# EAGLE design Enclosure 100x68 BCS-A4a (EAGLE 9.6.2)
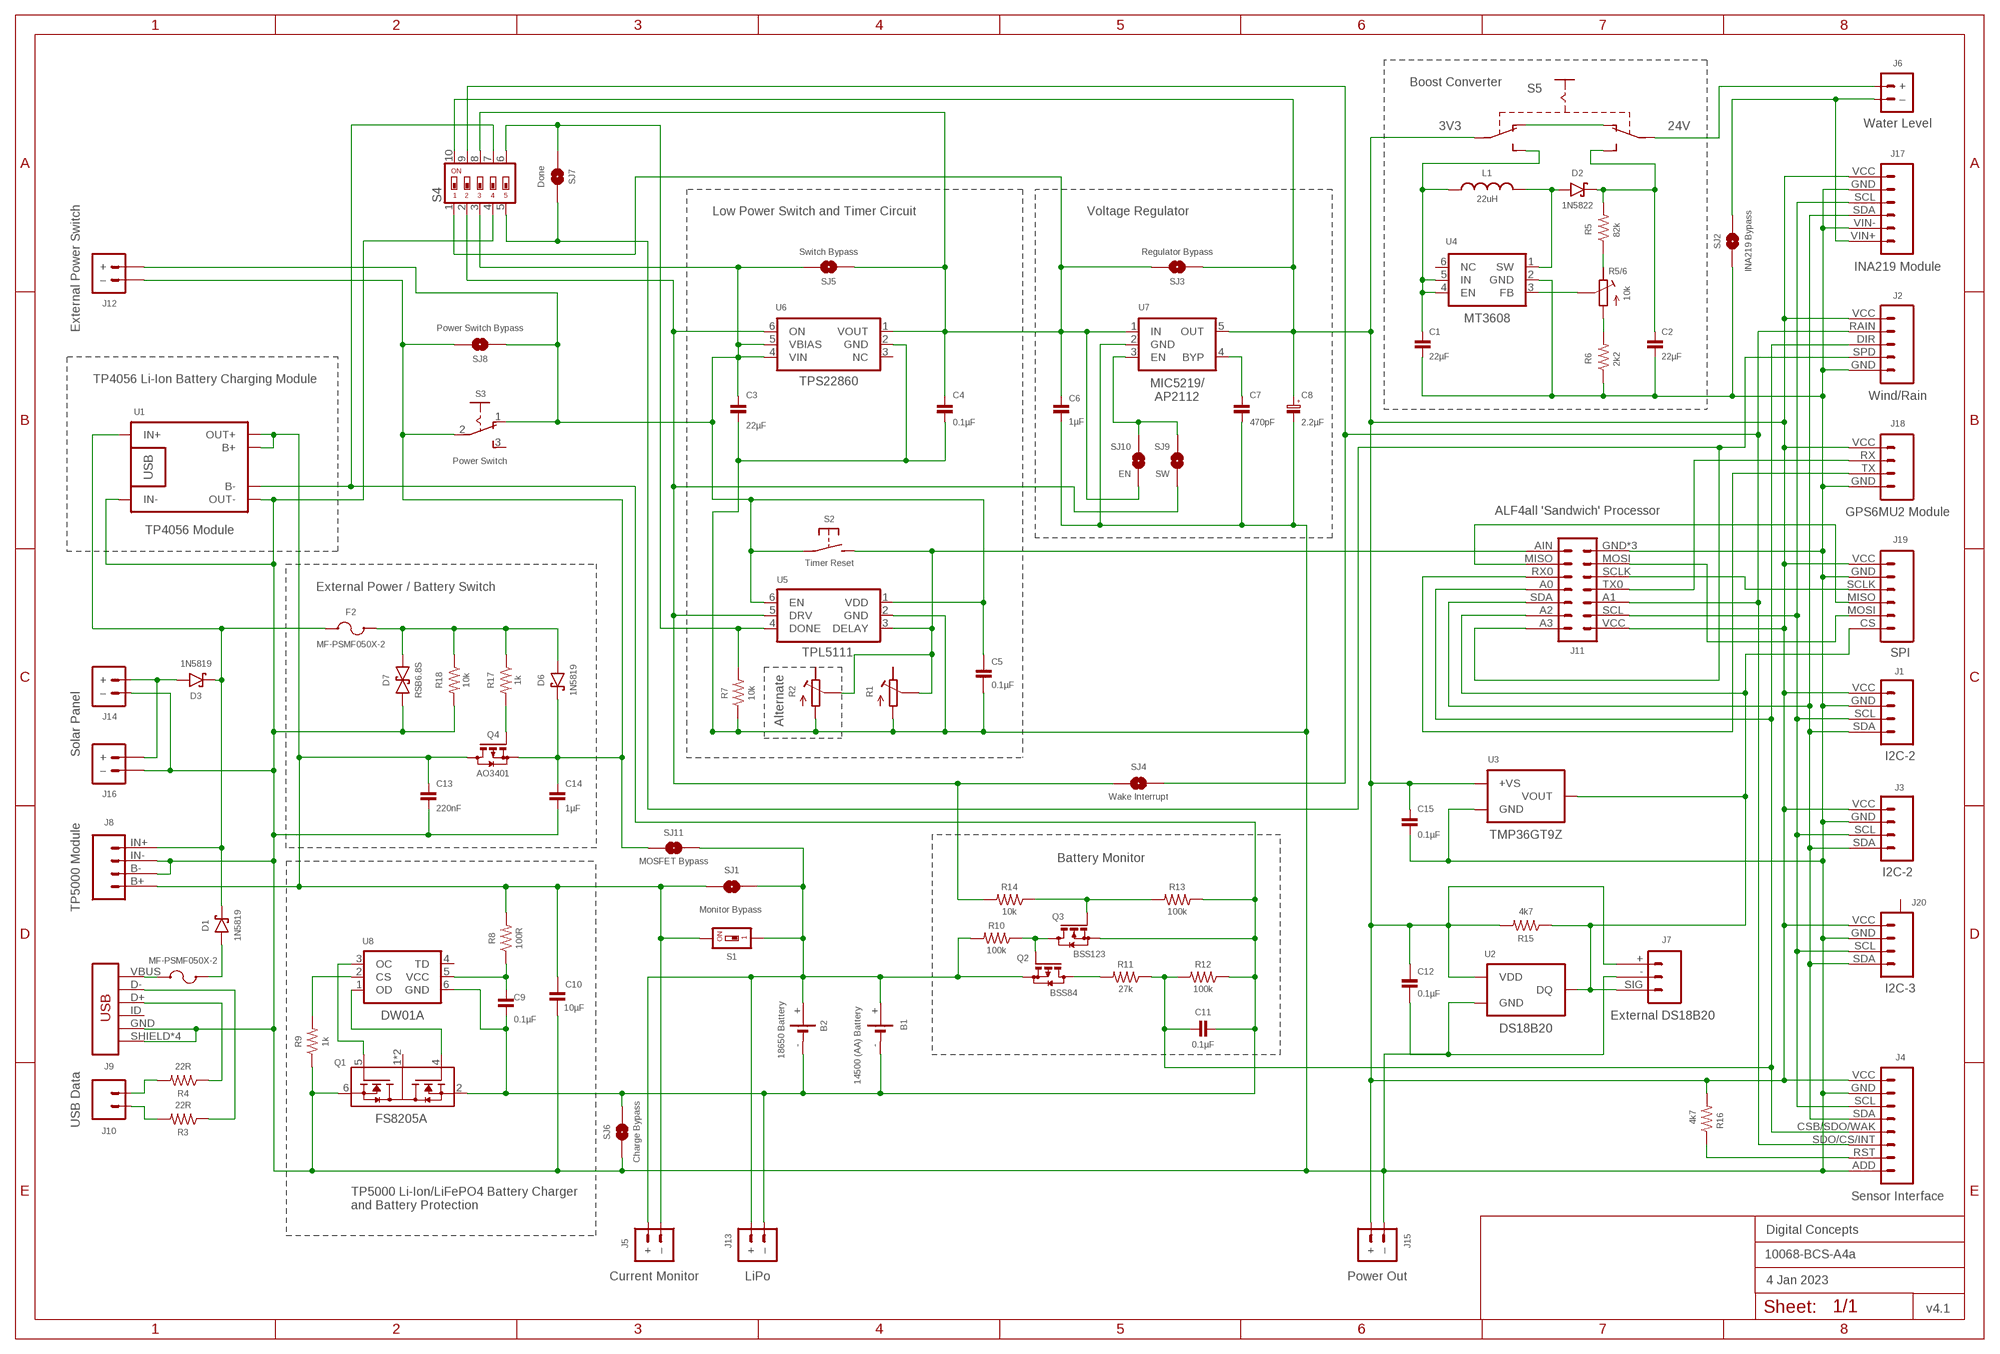
[diagram p0: schematic, sheet 1]
FRAME2 (A3L-LOC): DATE: 4 Jan 2023; OWNER: Digital Concepts; TITLE: 10068-BCS-A4a; VERSION: v4.1

## Parts
B1  14500 (AA) Battery  BATTERY-HOLDER-14500(AA)  [BATTERY-14500]
B2  18650 Battery  BATTERY-HOLDER-18650  [BATTERY-18650]
C1  22µF  CAPACITOR-1206  [C1206]
C2  22µF  CAPACITOR-1206  [C1206]
C3  22µF  CAPACITOR-0805  [C0805]
C4  0.1µF  CAPACITOR-0805  [C0805]
C5  0.1µF  CAPACITOR  [C0805@1]
C6  1µF  CAPACITOR-0805  [C0805]
C7  470pF  CAPACITOR-0805  [C0805]
C8  2.2µF  CAPACITOR-1206-TANTALUM  [C1206-POLARISED]
C9  0.1µF  CAPACITOR-0805  [C0805]
C10  10µF  CAPACITOR-VIA-2  [C0805-VIA-2@1]
C11  0.1µF  CAPACITOR-0805  [C0805]
C12  0.1µF  CAPACITOR-VIA-2  [C0805-VIA-2@1]
C13  220nF  CAPACITOR-0805  [C0805]
C14  1µF  CAPACITOR-0805  [C0805]
C15  0.1µF  CAPACITOR-0805  [C0805]
D1  1N5819  DIODE-SCHOTTKY-1N5819  [SOD-123]
D2  1N5822  DIODE-SCHOTTKY-1N5822  [DIODE_SMB]
D3  1N5819  DIODE-SCHOTTKY-1N5819  [SOD-123]
D6  1N5819  DIODE-SCHOTTKY-1N5819  [SOD-123]
D7  RSB6.8S  DIODE-SCHOTTKY-BIDIRECTIONAL  [VMD2]
F1  MF-PSMF050X-2  [F0805]
F2  MF-PSMF050X-2  [F0805]
J1  I2C-2  JST-PH2.0-4-DUAL-I2C  [JST-PH2.0-4-DUAL-I2C]
J2  Wind/Rain  JST-PH2.0-5-DUAL-WEATHER  [JST-PH2.0-5-DUAL-WEATHER]
J3  I2C-2  HEADER-1X4-I2C  [CONN_04-I2C]
J4  Sensor Interface  HEADER-1X8-SENSOR  [CONN_08-SENSOR]
J5  Current Monitor  JST-PH2.0-2-MALE-HORIZONTALJST-PTH-2  [JST-PH2.0-2-HORIZONTAL]
J6  Water Level  JST-PH2.0-2-MALE-VERTICAL  [JST-PH2.0-2-VERTICAL]
J7  External DS18B20  JST-PH2.0-DS18B20-HORIZONTAL  [JST-PH2.0-DS18B20-HORIZONTAL]
J8  TP5000 Module  HEADER-1X4-TP5000  [CONN_04-TP5000]
J9  USB  USB_MINI-B_SMT  [USB-MINIB]
J10  USB Data  1X2-PIN-HEADER  [CONN_02-GENERIC]
J11  ALF4all 'Sandwich' Processor  ALF4ALL-PROCESSOR-BOARD  [ALF4ALL-PROCESSOR-BOARD]
J12  External Power Switch  JST-PH2.0-2-DUAL-POWERJST-PTH-2  [JST-PH2.0-2-DUAL-POWER]
J13  LiPo  JST-PH2.0-2-MALE-HORIZONTALJST-PTH-2  [JST-PH2.0-2-HORIZONTAL]
J14  Solar Panel  JST-PH2.0-2-VERTICAL  [JST-PH2.0-2-VERTICAL=POWER]
J15  Power Out  JST-SH1.25-2-VERTICAL  [JST-SH1.25-2-VERTICAL]
J16  JST-PH2.0-2-HORIZONTAL-POWERJST-PTH-2  [JST-PH2.0-2-HORIZONTAL-POWER]
J17  INA219 Module  INA219-I2C-MODULE  [CONN_06-INA219]
J18  GPS6MU2 Module  HEADER-1X4-GPS  [CONN_04-GPS]
J19  SPI  JST-PH2.0-6-HORIZONTAL-SPI  [JST-PH2.0-6-HORIZONTAL-SPI]
J20  I2C-3  JST-SH1.0-4-I2C-HORIZONTAL  [JST-SH1.0-4-I2C-HORIZONTAL]
L1  22uH  INDUCTOR-CDRH104R/6D28L5038P  [CDRH104R+6D28]
Q1  FS8205A  MOSFET-DUAL-FS8205A  [FS8205-SOP?]
Q2  BSS84  [SOT23-3@1]
Q3  BSS123  MOSFET-BSS123  [SOT23-3]
Q4  AO3401  MOSFET-AO3401  [SOT-23]
R1  RESISTOR-TRIMM-BAOTER-VERTICAL  [RTRIM3296]
R2  RESISTOR-TRIMM-33  [RTRIM3*3]
R3  22R  RESISTOR-VIA-1  [R0805-VIA-1]
R4  22R  RESISTOR-VIA-1  [R0805-VIA-1]
R5  82k  RESISTORR0805  [R0805]
R5/6  10k  RESISTOR-TRIMM-BAOTER-HORIZONTAL  [RTRIM64P]
R6  2k2  RESISTORR0805  [R0805]
R7  10k  RESISTORR0805  [R0805]
R8  100R  RESISTORR0805  [R0805]
R9  1k  RESISTORR0805  [R0805]
R10  100k  RESISTORR0805  [R0805]
R11  27k  RESISTORR0805  [R0805]
R12  100k  RESISTORR0805  [R0805]
R13  100k  RESISTORR0805  [R0805]
R14  10k  RESISTORR0805  [R0805]
R15  4k7  RESISTORR0805  [R0805]
R16  4k7  RESISTORR0805  [R0805]
R17  1k  RESISTORR0805  [R0805]
R18  10k  RESISTORR0805  [R0805]
S1  Monitor Bypass  SWITCH-DIP-SWS001-VIA-1  [SMD-001-VIA-1]
S2  Timer Reset  SWITCH-MOMENTARY-2-PIN-VIA-1  [SWITCH-2-PAD-VIA-1]
S3  Power Switch  SWITCH-SLIDE-SPDT  [SWITCH-SPDT-PTH]
S4  SWITCH-DIP-SWS005  [SMD-005]
S5  SWITCH-SLIDE-DPDT-PTH-S  [SWITCH-DPDT-PTH]
SJ1  Monitor Bypass  SJ  [SJ]
SJ2  INA219 Bypass  SJ  [SJ]
SJ3  Regulator Bypass  SJ-V-12  [SJ-VIA-12]
SJ4  Wake Interrupt  SJ-V-1  [SJ-VIA-1]
SJ5  Switch Bypass  SJ-V-1  [SJ-VIA-1]
SJ6  Charge Bypass  SJ-V-1  [SJ-VIA-1]
SJ7  Done  SJ-V-1  [SJ-VIA-1]
SJ8  Power Switch Bypass  SJ  [SJ]
SJ9  SW  SJ  [SJ]
SJ10  EN  SJ  [SJ]
SJ11  MOSFET Bypass  SJ  [SJ]
U1  TP4056 Module  BATTERY-CHARGER-LI-PROT  [BATTERY-CHARGER-LI-PROT]
U2  DS18B20  THERMOMETER-DS18B20  [TO-92]
U3  TMP36GT9Z  THERMOMETER-TMP35GT9Z  [TO-92]
U4  MT3608  [SOT-23-6]
U5  TPL5111  TPL5111DDCR  [SOT-23-6]
U6  TPS22860  [SOT-23-6]
U7  MIC5219  [SOT-23-5]
U8  DW01A  [SOT-23-6]

## Nets
GND: C1.2 C2.2 C3.2 C4.1 C5.1 C6.2 C7.2 C8.2(-) C10.2 C10.2@VIA C12.2 C12.2@VIA C13.2 C14.2 C15.2 D7.P$2 J1.GND J2.GND J3.GND J4.ADD J4.GND J7.- J8.B- J8.IN- J9.GND J9.SHIELD J9.SHIELD@2(SHIELD) J9.SHIELD@3(SHIELD) J9.SHIELD@4(SHIELD) J11.GND J11.GND@TL J11.GND@TR J14.-(–) J15.-(–) J16.-(–) J17.GND J17.VIN- J18.GND J19.GND J20.GND Q1.6(S2) R1.1(A) R2.1(A) R6.1 R7.1 R9.1 R18.2 S4.4 SJ2.1 SJ6.1 SJ6.1@V U1.IN- U1.OUT- U2.1(GND) U3.3(GND) U4.2(GND) U5.2(GND) U6.2(GND) U7.2(GND)
N$1: D3.A J14.+ J16.+
N$2: C4.2 C6.1 S4.1 S4.8 SJ3.2 SJ3.2@V SJ5.1 SJ5.1@V SJ10.2 U6.1(VOUT) U7.1(IN)
N$3: R9.2 U8.2(CS)
N$4: J10.2 R4.2
N$5: R7.2 S4.6 SJ7.1 SJ7.1@V U5.4(DONE)
N$6: D2.A L1.1 U4.1(SW)
N$7: C7.1 U7.4(BYP)
N$8: J1.SCL J3.SCL J4.SCL J11.SCL J17.SCL J20.SCL
N$9: J4.RST R16.1
N$10: C11.1 J2.DIR J4.CSB/SDO/WAK J11.A0 R11.1 R12.2
N$11: J1.SDA J3.SDA J4.SDA J11.SDA J17.SDA J20.SDA
N$12: B1.+ B2.+ J5.+ J13.+ Q2.2(S) R10.2 S1.1 S1.1@VIA SJ1.1 SJ11.2
N$13: R5.1 R5/6.3(E)
N$14: J11.TX0 J18.RX
N$15: J6.-(–) J17.VIN+ SJ2.2
N$16: J11.RX0 J18.TX
N$18: Q1.5(G2) U8.3(OC)
N$19: F1.2 J9.VBUS
N$20: Q1.4(G1) U8.1(OD)
N$21: J9.D+ R4.1 R4.1@VIA
N$22: C9.1 R8.1 U8.5(VCC)
N$23: Q2.3(D) R11.2
N$24: J9.D- R3.1 R3.1@VIA
N$25: J11.AIN R1.2(S) R2.2(S) S2.2(S) U5.3(DELAY)
N$26: C3.1 C5.2 J12.+ S2.1(P) S2.1@VIA(P) S3.1(O) S4.3 SJ5.2 SJ8.1 U5.1(VDD) U5.6(EN) U6.4(VIN) U6.5(VBIAS)
N$27: R5/6.1(A) R6.2
N$28: R14.2 S4.2 SJ4.2 SJ9.2 U5.5(DRV) U6.6(ON)
N$29: J2.SPD J11.A3 S4.5 SJ7.2
N$30: J2.RAIN J4.SDO/CS/INT J11.A1 S4.9 SJ4.1 SJ4.1@V
N$31: R5/6.2(S) U4.3(FB)
N$32: C2.1 D2.C R5.2 S5.P$6(S2)
N$33: S5.P$1(O1) S5.P$4(O2)
N$34: C10.1 C13.1 J5.-(–) J8.B+ Q4.3(D) R8.2 S1.2 SJ1.2 U1.B+ U1.OUT+
N$35: Q2.1(G) Q3.3(D) R10.1
N$36: J6.+ S5.P$5(P2)
N$37: Q3.1(G) R13.2 R14.1
N$38: B1.- B2.- C9.2 C11.2 J13.-(–) Q1.2(S1) Q3.2(S) R12.1 R13.1 S4.7 SJ6.2 U1.B- U8.6(GND)
N$39: C1.1 L1.2 S5.P$3(S1) U4.4(EN) U4.5(IN)
N$40: C14.1 D6.C J12.-(–) Q4.2(S) S3.2(P) SJ8.2 SJ11.1
N$41: D1.C D3.C F2.1 J8.IN+ U1.IN+
N$42: J10.1 R3.2
N$43: Q4.1(G) R17.2
N$44: D6.A D7.P$1 F2.2 R17.1 R18.1
N$45: D1.A F1.1
N$46: SJ9.1 SJ10.1 U7.3(EN)
N$47: J11.SCLK J19.SCLK
N$48: J11.MOSI J19.MOSI
N$49: J7.SIG J11.A2 J19.CS R15.1 U2.2(DQ) U3.2(VOUT)
N$50: J11.MISO J19.MISO
VCC: C8.1(+) C12.1 C15.1 J1.VCC J2.VCC J3.VCC J4.VCC J7.+ J11.VCC J15.+ J17.VCC J18.VCC J19.VCC J20.VCC R15.2 R16.2 S4.10 S5.P$2(P1) SJ3.1 SJ3.1@V U2.3(VDD) U3.1(+VS) U7.5(OUT)
Unconnected: J9.ID J20.A@1(A) J20.A@4(A) Q1.1(D12) Q1.8(D12) R1.3(E) R2.3(E) S3.3(S) U4.6(NC) U6.3(NC) U8.4(TD)

## Notes on the sheet
- Boost Converter
- 3V3 | 24V
- Low Power Switch and Timer Circuit | Voltage Regulator
- TP4056 Li-Ion Battery Charging Module
- MIC5219/
  AP2112
- External Power / Battery Switch
- Alternate
- Battery Monitor
- TP5000 Li-Ion/LiFePO4 Battery Charger
  and Battery Protection

## Library data of the parts
B1 = digitalconcepts:BATTERY-HOLDER-14500(AA): 14500 (AA) battery holder
B2 = digitalconcepts:BATTERY-HOLDER-18650: 18650 Battery Holder
C1 C2 = digitalconcepts:CAPACITOR-1206: 1206 Capacitor
C3 C4 C6 C7 C9 C11 C13-C15 = digitalconcepts:CAPACITOR-0805: 0805 Capacitor
C5 = digitalconcepts:CAPACITOR: 0805 Capacitor
C8 = digitalconcepts:CAPACITOR-1206-TANTALUM: Capacitor 1206 Tantalum
C10 C12 = digitalconcepts:CAPACITOR-VIA-2: 0805 Capacitor with via on Pad 2
D1 D3 D6 = digitalconcepts:DIODE-SCHOTTKY-1N5819: 1N5819 Schottky Diode SOD-123
D2 = digitalconcepts:DIODE-SCHOTTKY-1N5822: 1N5822 Schottky Diode SMB
D7 = digitalconcepts:DIODE-SCHOTTKY-BIDIRECTIONAL: Schottky Bidirectional Diode
F1 F2 = digitalconcepts:MF-PSMF050X-2: PTC Resettable Fuse 0.5A/6V 500mA SMD
J1 = digitalconcepts:JST-PH2.0-4-DUAL-I2C: PH2.0 4P I2C Dual Connector
J2 = digitalconcepts:JST-PH2.0-5-DUAL-WEATHER: PH2.0 5P Vertical Connector
J3 = digitalconcepts:HEADER-1X4-I2C: I2C Interface [Pin 1 Vcc] 4-Pin Header
J4 = digitalconcepts:HEADER-1X8-SENSOR: IoT Sensors 1x8 Pin Header for 'Sandwich' IoT Sensors
J5 J13 = digitalconcepts:JST-PH2.0-2-MALE-HORIZONTAL: PH2.0 2P Right Angle PCB Connector; PROD_ID: CONN-09863; SKU: PRT-09914
J6 = digitalconcepts:JST-PH2.0-2-MALE-VERTICAL: PH2.0 2P PCB Connector
J7 = digitalconcepts:JST-PH2.0-DS18B20-HORIZONTAL: DS18B20 PH2.0 Right Angle PCB Connector
J8 = digitalconcepts:HEADER-1X4-TP5000: TP5000 Module 4-Pin Header
J9 = digitalconcepts:USB_MINI-B: USB Mini-B Connector Breaks out 5 pins, and includes shield pins if needed.
J10 = digitalconcepts:1X2-PIN-HEADER: Single Row 2-Pin Header
J11 = digitalconcepts:ALF4ALL-PROCESSOR-BOARD: ALF4all 'Sandwixh' Processor 2x7 Pin Header and earthed 1x1 locator pins for ALF4all 'Sandwich' Processor/RFM95W PCBs
J12 = digitalconcepts:JST-PH2.0-2-DUAL-POWER: JST PH2.0 2P PTH Dual-Side Connector (Power); PROD_ID: CONN-09863; SKU: PRT-09914
J14 = digitalconcepts:JST-PH2.0-2-VERTICAL: PH2.0 2P PCB Connector
J15 = digitalconcepts:JST-SH1.25-2-VERTICAL: SH1.25 Male PCB Connector
J16 = digitalconcepts:JST-PH2.0-2-HORIZONTAL-POWER: PH2.0 2P Right Angle PCB Connector; PROD_ID: CONN-09863; SKU: PRT-09914
J17 = digitalconcepts:INA219-I2C-MODULE: INA219 I2C Module
J18 = digitalconcepts:HEADER-1X4-GPS: NEO GPS 4-Pin Header
J19 = digitalconcepts:JST-PH2.0-6-HORIZONTAL-SPI: PH2.0 6P Horizontal Connector—SPI
J20 = digitalconcepts:JST-SH1.0-4-I2C-HORIZONTAL: JST SH1.0 SMD 4P I2C horizontal connector
L1 = digitalconcepts:INDUCTOR-CDRH104R/6D28: Inductor; SPICEPREFIX: L
Q1 = digitalconcepts:MOSFET-DUAL-FS8205A: Dual MOSFET; AVAILABILITY: Unavailable; MF: Fortune Semiconductor; MP: FS8205A; PACKAGE: Package; PRICE: None
Q2 = digitalconcepts:BSS84: P-CHANNEL MOS FET
Q3 = digitalconcepts:MOSFET-BSS123: N-CHANNEL MOS FET
Q4 = digitalconcepts:MOSFET-AO3401: AO3401 P-Channel MOSFET
R1 = digitalconcepts:RESISTOR-TRIMM-BAOTER-VERTICAL: Trimm Resistor - Vertical BAOTER
R2 = digitalconcepts:RESISTOR-TRIMM-3*3: Trimm Resistor - 3*3 SMD
R3 R4 = digitalconcepts:RESISTOR-VIA-1: Resistor with via on Pad 1
R5-R18 = digitalconcepts:RESISTOR: Resistor; SPICEPREFIX: R
R5/6 = digitalconcepts:RESISTOR-TRIMM-BAOTER-HORIZONTAL: Trimm Resistor - Horizontal BAOTER
S1 = digitalconcepts:SWITCH-DIP-SWS001-VIA-1: SMD Dip Switch 1 pol.
S2 = digitalconcepts:SWITCH-MOMENTARY-2-PIN-VIA-1: 2 Pin Momentary Switch
S3 = digitalconcepts:SWITCH-SLIDE-SPDT: Mini Sliding Switch SPDT
S4 = digitalconcepts:SWITCH-DIP-SWS005: SMD Dip Switch 5 pol.
S5 = digitalconcepts:SWITCH-SLIDE-DPDT-PTH-S: Switch DPDT PTH-S
SJ1 SJ2 SJ8-SJ11 = digitalconcepts:SJ: Solder Jumper
SJ3 = digitalconcepts:SJ-V-12: Solder Jumper with Pad Vias
SJ4-SJ7 = digitalconcepts:SJ-V-1: Solder Jumper with single Pad Via
U1 = digitalconcepts:BATTERY-CHARGER-LI-PROT: TP4056 Li Battery Charger module with PCB (rather than module) footprint
U2 = digitalconcepts:THERMOMETER-DS18B20: Digital Thermometer -55C-125C TO92-3; AVAILABILITY: Bad; DESCRIPTION: Temperature Sensor Digital, Local -55°C ~ 125°C 12 b 8-uMAX; MF: Maxim Integrated; MP: DS18B20; PACKAGE: TO-92 Maxim Integrated; PRICE: None
U3 = digitalconcepts:THERMOMETER-TMP35GT9Z: Temperature Sensor; AVAILABILITY: Warning; DESCRIPTION: Temperature Sensor Analog, Local 10°C ~ 125°C 10mV/°C TO-92-3; MF: Analog Devices; MOUSER-PURCHASE-URL: https://snapeda.com/shop?store=Mouser&id=409845; MP: TMP35GT9Z; PACKAGE: TO-92-3 Analog Devices; PRICE: None
U4 = digitalconcepts:MT3608: MT3608 DC-DC Step-Up Voltage Converter
U5 = digitalconcepts:TPL5111DDCR: TPL5111 Nano-Power System Timer
U6 = digitalconcepts:TPS22860: Texas Instruments TPS22860 Ultra-Low Leakage Load Switch
U7 = digitalconcepts:MIC5219: Microchip LDO Linear Voltage Regulator; OC_FARNELL: unknown; OC_NEWARK: unknown
U8 = digitalconcepts:DW01A: Battery Protection IC; AVAILABILITY: Unavailable; DESCRIPTION: One Cell Lithium-ion/Polymer Battery Protection IC; MF: Fortune Semiconductor; MP: DW01A; PACKAGE: SOT-23-6 Fortune Semiconductor; PRICE: None

## Board
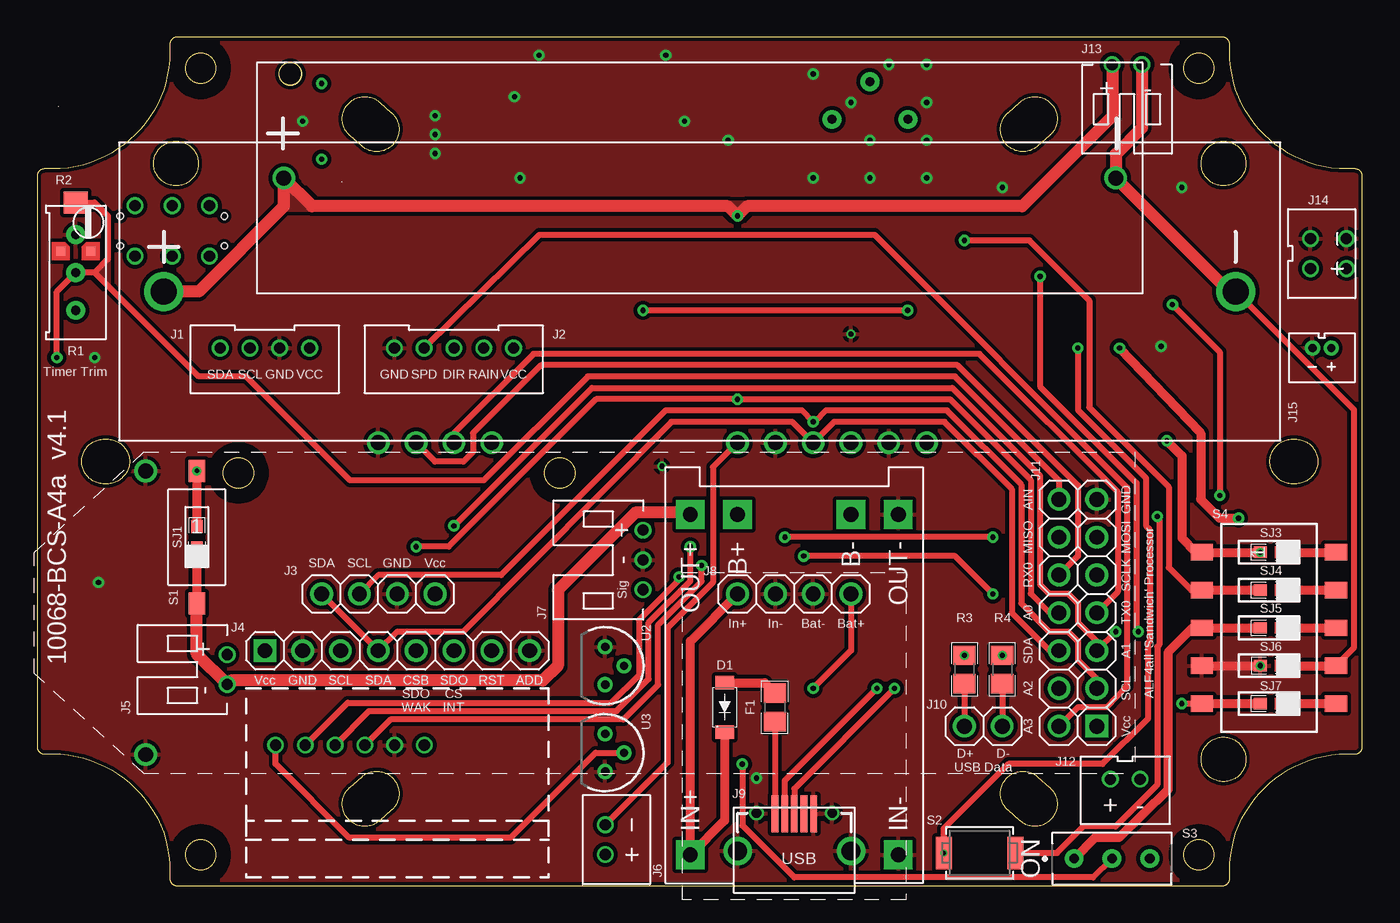
[diagram p1: board, top side]
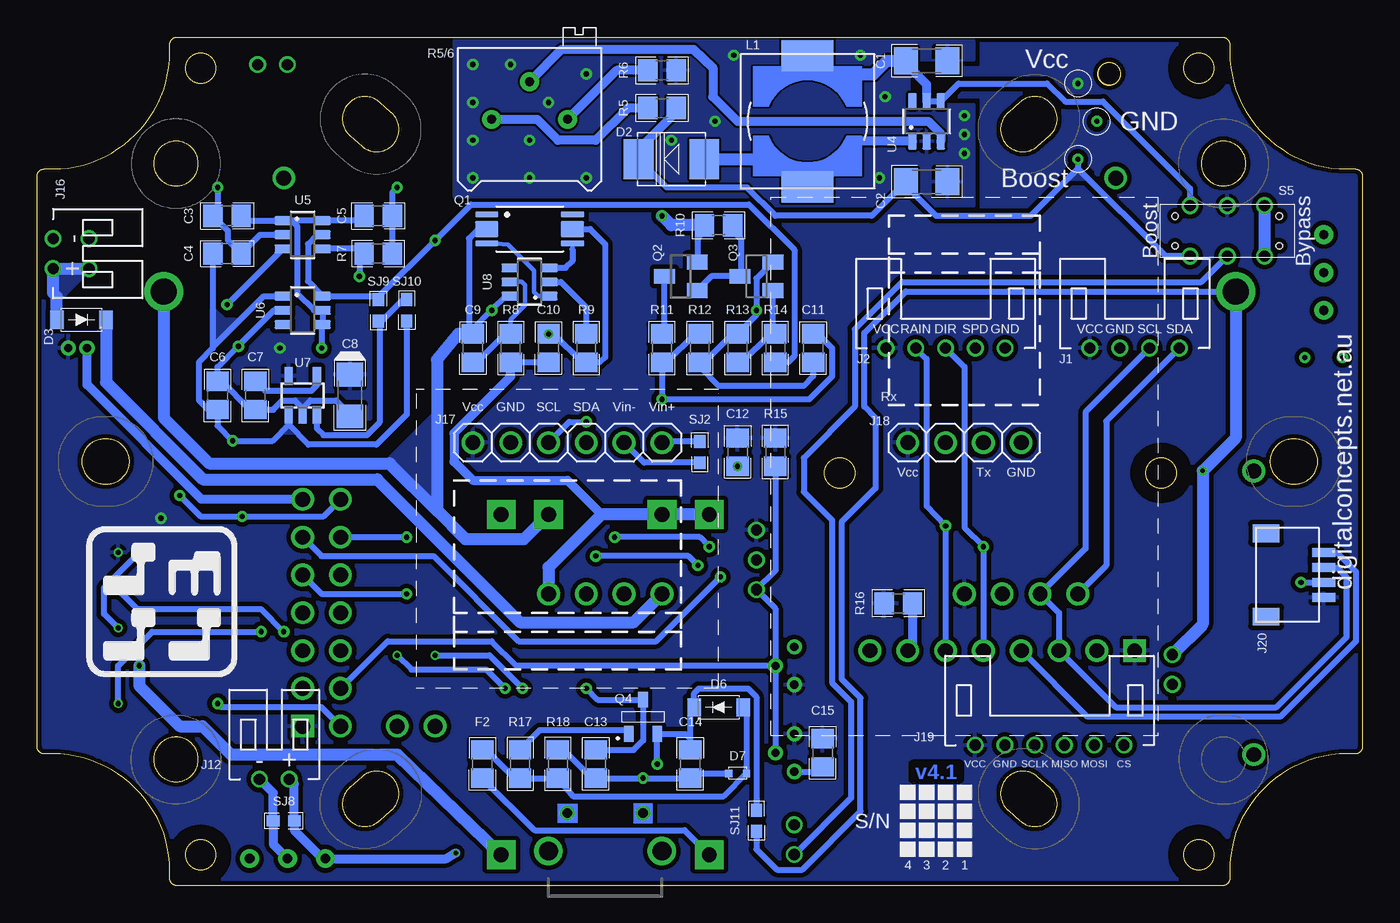
[diagram p2: board, bottom side, seen from below]

Size 89 x 57 mm. Coordinates in mm from the lower left corner, seen from the top.
Outline: 1146 segments
Outline: circle at 17,54.54 radius 0.76
Outline: circle at 10.97,54.91 radius 1.02
Outline: circle at 10.97,2.08 radius 1.02
Outline: circle at 13.51,27.73 radius 1.02
Outline: circle at 35.1,27.73 radius 1.02
Outline: circle at 78.03,2.08 radius 1.02
Outline: circle at 78.03,54.91 radius 1.02
Copper layers (1*16): Top 0.035mm / dielectric 1.5mm / Bottom 0.035mm
Design rules "default *": minimum track width 6mil, minimum drill 0.3mm, track to track 6mil, track to pad 6mil, pad to pad 6mil, via to via 6mil, smd to smd 6mil, copper to edge 6mil, drill to drill 6mil, minimum pad ring 1mil, minimum via ring 8mil, stop-mask expansion 4mil, vias tented up to drill 0mil, thermal gap 10mil

### Footprints (pad centres in the part's own frame; a part is rotated, then mirrored left to right if it is on the bottom)
BATTERY-14500 = drill 1: + -27.94,0; - 27.94,0
BATTERY-18650 = drill 1.75: + -36,0; - 36,0
C1206 = smd 1.6 x 1.8: 1 -1.4,0; 2 1.4,0
C0805 = smd 1.3 x 1.5: 1 -0.95,0; 2 0.95,0
C0805@1 = smd 1.3 x 1.5: 1 -0.95,0; 2 0.95,0
C1206-POLARISED = smd 1.6 x 1.8: 1 -1.4,0; 2 1.4,0
C0805-VIA-2@1 = smd 1.3 x 1.5: 1 -0.95,0; 2 0.95,0 | drill 0.35 pad 0.61: 2@VIA 0.95,0
SOD-123 = smd 0.91 x 1.22: A -1.65,0; C 1.65,0
DIODE_SMB = smd 2 x 2.7: A 2.2,0; C -2.2,0
VMD2 = smd 0.5 x 0.5: P$1 -0.6,0; P$2 0.6,0
F0805 = smd 1.3 x 1.5: 1 -0.95,0; 2 0.95,0
JST-PH2.0-4-DUAL-I2C = drill 0.75: GND -1,0; SCL 1,0; SDA 3,0; VCC -3,0
JST-PH2.0-5-DUAL-WEATHER = drill 0.75: DIR 0,0; GND 4,0; RAIN -2,0; SPD 2,0; VCC -4,0
CONN_04-I2C = drill 1 pad 1.524: GND 2.54,0; SCL 5.08,0; SDA 7.62,0; VCC 0,0
CONN_08-SENSOR = drill 1 pad 1.524: ADD 17.78,0; CSB/SDO/WAK 10.16,0; GND 2.54,0; RST 15.24,0; SCL 5.08,0; SDA 7.62,0; SDO/CS/INT 12.7,0 | drill 1 pad 1.524 square: VCC 0,0
JST-PH2.0-2-HORIZONTAL = drill 0.75: + 1,0; - -1,0
JST-PH2.0-2-VERTICAL = drill 0.75: + -1,0; - 1,0
JST-PH2.0-DS18B20-HORIZONTAL = drill 0.75: + 2,0; - 0,0; SIG -2,0
CONN_04-TP5000 = drill 1 pad 1.524: B+ 0,0; B- 2.54,0; IN+ 7.62,0; IN- 5.08,0
USB-MINIB = smd 2.5 x 0.45: D+ 2.5,0; D- 2.5,0.65; GND 2.5,-1.3; ID 2.5,-0.65; VBUS 2.5,1.3 | drill 1.27: SHIELD 0,3.81; SHIELD@2 0,-3.81 | drill 0.65 pad 0.762: SHIELD@3 2.54,2.54; SHIELD@4 2.54,-2.54
CONN_02-GENERIC = drill 1 pad 1.524: 1 0,0; 2 2.54,0
ALF4ALL-PROCESSOR-BOARD = drill 1 pad 1.524: A0 7.62,2.54; A1 5.08,0; A2 2.54,2.54; A3 0,2.54; AIN 15.24,2.54; GND 15.24,0; GND@TL -1.905,63.881; GND@TR 17.145,63.881; MISO 12.7,2.54; MOSI 12.7,0; RX0 10.16,2.54; SCL 2.54,0; SCLK 10.16,0; SDA 5.08,2.54; TX0 7.62,0 | drill 1 pad 1.524 square: VCC 0,0
JST-PH2.0-2-DUAL-POWER = drill 0.75: + 1,0; - -1,0
JST-PH2.0-2-VERTICAL=POWER = drill 0.75: + -1,0; - 1,0
JST-SH1.25-2-VERTICAL = drill 0.55 pad 1.016: + 0.625,0; - -0.625,0
JST-PH2.0-2-HORIZONTAL-POWER = drill 0.75: + 1,0; - -1,0
CONN_06-INA219 = drill 1 pad 1.524: GND 2.54,0; SCL 5.08,0; SDA 7.62,0; VCC 0,0; VIN+ 12.7,0; VIN- 10.16,0
CONN_04-GPS = drill 1 pad 1.524: GND 0,0; RX 5.08,0; TX 2.54,0; VCC 7.62,0
JST-PH2.0-6-HORIZONTAL-SPI = drill 0.75: CS 5,0; GND -3,0; MISO 1,0; MOSI 3,0; SCLK -1,0; VCC -5,0
JST-SH1.0-4-I2C-HORIZONTAL = smd 1.2 x 1.8: A@1 -2.8,-3.875; A@4 2.8,-3.875 | smd 0.6 x 1.55: GND 0.5,0; SCL -0.5,0; SDA -1.5,0; VCC 1.5,0
CDRH104R+6D28 = smd 2.1 x 3.5: 1 -4.4,0; 2 4.4,0
FS8205-SOP? = smd 1.56 x 0.4: 1 -2.88,0.975; 4 -2.88,-0.975; 5 2.88,-0.975; 8 2.88,0.975 | smd 1.56 x 1.05: 2 -2.88,0; 6 2.88,0
SOT23-3@1 = smd 1 x 1.4: 1 -0.95,-1.1; 2 0.95,-1.1; 3 0,1.1
SOT23-3 = smd 1 x 1.4: 1 -0.95,-1.1; 2 0.95,-1.1; 3 0,1.1
SOT-23 = smd 0.65 x 1.05: 1 -0.95,-1.15; 2 0.95,-1.15; 3 0,1.15
RTRIM3296 = drill 0.61 pad 1.27: 1 0,-2.54; 2 0,0; 3 0,2.54
RTRIM3*3 = smd 0.6 x 0.6: 1 -1,-1.6; 3 1,-1.6 | smd 1.6 x 1.5: 2 0,1.65
R0805-VIA-1 = smd 1.3 x 1.5: 1 -0.95,0; 2 0.95,0 | drill 0.35 pad 0.61: 1@VIA -0.95,0
R0805 = smd 1.3 x 1.5: 1 -0.95,0; 2 0.95,0
RTRIM64P = drill 0.61 pad 1.27: 1 0,-2.54; 2 2.54,0; 3 0,2.54
SMD-001-VIA-1 = smd 1.1 x 1.5: 1 0,-4.45; 2 0,4.45 | drill 0.3 pad 0.61: 1@VIA 0,-4.45
SWITCH-2-PAD-VIA-1 = smd 1.067 x 2.184: 1 -2.4,0; 2 2.4,0 | drill 0.3: 1@VIA -2.4,0
SWITCH-SPDT-PTH = drill 0.65 pad 1.27: 1 -2.54,0; 2 0,0; 3 2.54,0
SMD-005 = smd 1.1 x 1.5: 1 -5.08,-4.5; 2 -2.54,-4.5; 3 0,-4.5; 4 2.54,-4.5; 5 5.08,-4.5; 6 5.08,4.5; 7 2.54,4.5; 8 0,4.5; 9 -2.54,4.5; 10 -5.08,4.5
SWITCH-DPDT-PTH = drill 0.75: P$1 -1.7,2.5; P$2 -1.7,0; P$3 -1.7,-2.5; P$4 1.7,2.5; P$5 1.7,0; P$6 1.7,-2.5 | hole 0.42: 1,3.5; -1,3.5; 1,-3.5; -1,-3.5
SJ = smd 0.864 x 0.762: 1 -0.711,0; 2 0.711,0
SJ-VIA-12 = smd 0.864 x 0.762: 1 -0.711,0; 2 0.711,0 | drill 0.35 pad 0.61: 1@V -0.711,0; 2@V 0.711,0
SJ-VIA-1 = smd 0.864 x 0.762: 1 -0.711,0; 2 0.711,0 | drill 0.35 pad 0.61: 1@V -0.711,0
BATTERY-CHARGER-LI-PROT = drill 1 pad 1.93 square: B+ 10.795,3.81; B- 10.795,-3.81; IN+ -12.065,6.985; IN- -12.065,-6.985; OUT+ 10.795,6.985; OUT- 10.795,-6.985
TO-92 = drill 0.55 pad 1.016: 1 -1.27,0; 2 0,1.27; 3 1.27,0
SOT-23-6 = smd 1.1 x 0.6: 1 -1.35,0.95; 2 -1.35,0; 3 -1.35,-0.95; 4 1.35,-0.95; 5 1.35,0; 6 1.35,0.95
SOT-23-5 = smd 0.55 x 1.2: 1 -0.95,-1.3; 2 0,-1.3; 3 0.95,-1.3; 4 0.95,1.3; 5 -0.95,1.3

### Placement (x,y rotation side)
B1  44.5,47.54 0 top
B2  44.5,39.92 0 top
C1  29.26,55.42 0 bottom
C2  29.26,47.29 0 bottom
C3  76.25,45 180 bottom
C4  76.25,42.46 180 bottom
C5  66.09,45 180 bottom
C6  76.88,32.94 90 bottom
C7  74.34,32.94 270 bottom
C8  67.99,32.94 270 bottom
C9  59.74,36.11 90 bottom
C10  54.66,36.11 90 bottom
C11  36.88,36.11 270 bottom
C12  41.96,29.13 270 bottom
C13  51.48,8.17 270 bottom
C14  45.13,8.17 270 bottom
C15  36.24,8.93 270 bottom
D1  46.18,11.98 270 top
D2  46.4,48.81 0 bottom
D3  86.03,38.02 0 bottom
D6  43.23,11.98 180 bottom
D7  41.96,7.54 180 bottom
F1  49.55,11.98 270 top
F2  59.1,8.17 90 bottom
J1  15.29,36.11 0 bottom
J2  27.99,36.11 0 bottom
J3  26.72,19.6 180 top
J4  15.29,15.79 0 top
J5  12.75,14.52 90 top
J6  38.15,3.09 90 top
J7  40.69,21.89 90 top
J8  54.66,19.6 180 top
J9  50.85,2.33 90 top
J10  62.28,10.71 0 top
J11  71.17,10.71 90 top
J12  73.07,7.16 0 bottom
J13  73.2,55.16 180 top
J14  85.52,42.46 90 top
J15  86.28,36.11 0 top
J16  87.93,42.46 270 bottom
J17  59.74,29.76 0 bottom
J18  22.91,29.76 180 bottom
J19  21,9.44 0 bottom
J20  2.59,20.87 270 bottom
L1  37.26,51.35 90 bottom
Q1  55.93,44.11 0 bottom
Q2  45.77,40.94 90 bottom
Q3  40.69,40.94 90 bottom
Q4  48.31,11.35 0 bottom
R1  2.59,41.19 180 top
R2  2.59,44.24 0 top
R3  62.28,14.52 270 top
R4  64.82,14.52 270 top
R5  47.04,52.24 0 bottom
R5/6  55.93,51.48 90 bottom
R6  47.04,54.78 180 bottom
R7  66.09,42.46 180 bottom
R8  57.2,36.11 270 bottom
R9  52.12,36.11 90 bottom
R10  43.23,44.37 180 bottom
R11  47.04,36.11 90 bottom
R12  44.5,36.11 90 bottom
R13  41.96,36.11 270 bottom
R14  39.42,36.11 270 bottom
R15  39.42,29.13 90 bottom
R16  31.16,18.97 180 bottom
R17  56.56,8.17 90 bottom
R18  54.02,8.17 90 bottom
S1  10.72,23.41 180 top
S2  63.3,2.2 0 top
S3  72.19,1.82 0 top
S4  82.73,17.32 270 top
S5  9.07,43.99 270 bottom
SJ1  10.72,23.41 270 top
SJ2  44.5,29.13 90 bottom
SJ3  82.85,22.4 180 top
SJ4  82.85,19.86 180 top
SJ5  82.85,17.32 180 top
SJ6  82.85,14.78 0 top
SJ7  82.85,12.24 180 top
SJ8  72.44,4.36 180 bottom
SJ9  66.09,38.65 90 bottom
SJ10  64.18,38.65 270 bottom
SJ11  40.69,4.36 270 bottom
U1  50.85,14.14 90 top
U2  38.15,14.78 270 top
U3  38.15,8.93 270 top
U4  29.26,51.35 90 bottom
U5  71.17,43.73 0 bottom
U6  71.17,38.65 0 bottom
U7  71.17,32.94 0 bottom
U8  55.93,40.56 180 bottom

### Tracks (layer width: path | path; a pad name or v marks a point on that pad's centre or on a via)
$X0
  cutout Bottom: 10.97,56.94 arc180 10.97,52.88 arc180
$X1
  cutout Bottom: 78.03,56.94 arc180 78.03,52.88 arc180
$X2
  cutout Bottom: 78.03,4.11 arc180 78.03,0.04 arc180
$X3
  cutout Bottom: 10.97,4.11 arc180 10.97,0.04 arc180
$X4
  cutout Top: 10.97,56.94 arc180 10.97,52.88 arc180
$X5
  cutout Top: 78.03,56.94 arc180 78.03,52.88 arc180
$X6
  cutout Top: 78.03,4.11 arc180 78.03,0.04 arc180
$X7
  cutout Top: 10.97,4.11 arc180 10.97,0.04 arc180
$X8
  cutout Bottom: 13.51,29.76 arc180 13.51,25.7 arc180
$X9
  cutout Top: 35.1,29.76 arc180 35.1,25.7 arc180
$X10
  cutout Top: 13.51,29.76 arc180 13.51,25.7 arc180
$X11
  cutout Bottom: 35.1,29.76 arc180 35.1,25.7 arc180
GND  (via drill 0.35)
  Top 0.61: S4.4 SJ6.1@V
  Bottom 0.406: D7.P$2 44.82,7.54 C14.2 v48.31,7.22 C13.2 51.74,7.22 53.64,9.12 R18.2 | C10.2@VIA 54.3,37.06 52.4,35.16 R9.1 51.24,35.16 50.85,35.5 50.85,43.1 51.87,44.11 Q1.6 | R7.1 C5.1 65.14,46.59 v64.82,46.91 | U5.2 74.03,43.73 C4.1 76.19,43.36 76.19,43.99 C3.2 76.88,45.32 v76.88,46.91 | U3.3 36.56,7.66 C15.2 | v4.11,20.37 J20.GND | C8.2 67.99,31.67 68.92,32.59 70.64,32.59 71.17,32.07 | U6.2 73.07,38.65 v75.49,36.24 76.88,34.84 C6.2 76.63,33.89 74.73,31.99 C7.2 73.15,31.99 72.54,32.59 71.7,32.59 71.17,32.07 | U7.2 71.17,32.07 | SJ2.1 48.23,28.42 J17.VIN-
  Bottom 0.61: J15.- 85.66,33.66 77.95,25.95 J11.GND
  Bottom 0.813: U1.IN- 64.82,8.81 76,8.81 77.9,10.71 79.42,10.71 82.14,13.43 SJ6.1@V
  other vias: 26.72,51.73 26.72,50.46 26.72,49.19 46.4,50.08 32.05,53 52.12,47.54 55.93,47.54 59.74,55.16 59.74,52.62 52.12,54.53 55.93,50.08 59.74,47.54 59.74,50.08 42.21,55.8 43.48,51.35 32.43,47.54 17.83,51.35 3.86,35.48 33.7,55.8 57.2,55.16 54.66,52.62
  pour Top (isolate 0.254, rank 5): -2.92,59.5 -2.92,-2.56 91.86,-2.56 91.86,59.5
  pour Bottom (rank 2): 61.01,57.07 26.08,57.07 26.08,55.44 30.4,55.44 30.4,52.5 26.08,52.5 26.08,45.64 39.42,45.64 40.05,46.27 61.01,46.27
  pour Bottom (no thermals): 71.17,32.07 70.64,32.59 71.7,32.59
N$1
  Bottom 0.813: D3.A 87.68,39.56 87.93,39.81 J16.+ J14.+
  pour Bottom (no thermals): 87.68,41.46 85.77,41.46 87.68,39.56
N$2  (via drill 0.35)
  Top 0.61: v75.87,29.89 76.88,28.87 76.88,23.35 77.83,22.4 S4.1 SJ3.2@V | SJ5.1@V S4.8
  Bottom 0.406: 72.12,30.97 73.2,29.89 v75.87,29.89 76.88,30.91 C6.1 77.52,31.99 78.15,32.62 78.15,35.16 77.2,36.11 77.2,36.18 | SJ3.2@V 84.5,20.03 84.5,18.26 SJ5.1@V | C4.2 77.2,36.18 | 72.12,30.97 70.79,29.64 66.22,29.64 64.18,31.67 SJ10.2 | 72.12,30.97 U7.1 | 77.2,36.18 73.78,39.6 U6.1
  pour Bottom (no thermals): 77.2,38.72 76.46,37.97 75.4,37.97 77.2,36.18
  pour Bottom (no thermals): 72.56,30.52 71.68,30.52 72.12,30.97
N$3
  Bottom 0.406: U8.2 53.82,40.56 52.14,38.88 52.14,37.09 R9.2
N$4
  Top 0.406: R4.2 J10.2
N$5  (via drill 0.35)
  Top 0.406: v73.96,17.06 73.84,17.19 73.84,27.07 67.36,33.55 v67.36,40.94
  Top 0.61: SJ7.1@V S4.6
  Bottom 0.406: U5.4 66.72,42.78 R7.2 67.36,42.14 v67.36,40.94 | SJ7.1@V 83.56,14.78 81.28,17.06 v73.96,17.06
N$6
  Bottom 0.61: L1.1 36.31,48.3 35.66,48.3 33.96,50 U4.1
  Bottom 0.813: D2.A 39.9,48.81 39.42,48.3 38.21,48.3 L1.1
N$7
  Bottom 0.406: U7.4 70.22,33.6 70.57,33.25 73.71,33.25 C7.1
N$8  (via drill 0.35)
  Top 0.406: J11.SCL 71.17,13.89 69.9,15.16 69.9,16.43 69.26,17.06 67.99,17.06 66.09,18.97 66.09,26.94 61.11,31.92 52.99,31.92 52.23,31.16 v52.12,31.16 51.36,31.92 42.21,31.92 31.16,20.87 22.91,20.87 J3.SCL
  Bottom 0.406: v52.12,31.16 53.26,31.16 J17.SCL | J1.SCL 18.59,31.81 18.59,22.65 J3.SCL 20.37,18.33 J4.SCL 16.56,11.98 5.76,11.98 1.07,16.68 1.07,20.74 1.7,21.37 J20.SCL
N$9
  Bottom 0.61: J4.RST 30.21,16.11 R16.1
N$10  (via drill 0.35)
  Top 0.406: v25.45,22.78 27.63,22.78 37.54,32.68 v47.04,32.68 61.29,32.68 66.72,27.25 66.72,19.6 67.99,18.33 J11.A0
  Bottom 0.406: J4.CSB/SDO/WAK v25.45,22.78 26.72,24.05 26.72,34.84 J2.DIR | R12.2 44.83,37.06 46.73,35.16 R11.1 v47.04,32.68 37.13,32.68 35.61,34.21 35.61,36.11 36.24,36.75 36.56,36.75 C11.1
N$11
  Top 0.406: J11.SDA 67.99,15.79 65.45,18.33 65.45,26.64 60.93,31.16 53.52,31.16 J17.SDA 50.72,31.16 42.59,31.16 28.6,17.06 24.18,17.06 J4.SDA J3.SDA
  Bottom 0.406: J4.SDA 18.46,11.35 5.51,11.35 0.43,16.43 0.43,21.1 1.7,22.37 J20.SDA | J3.SDA 17.19,21.51 17.19,31.21 J1.SDA
N$12  (via drill 0.35)
  Top 0.61: S1.1@VIA SJ1.1
  Top 0.813: J13.+ 72.2,51.68 66.16,45.64 47.67,45.64 v47.04,45 46.4,45.64 18.46,45.64 B1.+ 16.56,45.64 10.84,39.92 B2.+
  Bottom 0.406: R10.2 44.18,43.96 44.64,43.5 44.64,41.92 Q2.2 | SJ11.2 40.69,2.46 39.32,1.09 37.62,1.09 33.7,5 33.7,12.62 34.97,13.89 34.97,24.43 32.69,26.71 32.69,31.41 33.45,32.18 33.45,37.13 30.66,39.92 B2.+
  Bottom 0.813: J5.+ 10.72,17.55 S1.1@VIA 8.5,30.08 B2.+ | v47.04,45 46.4,44.37 R10.2
  pour Top: 16.56,47.54 18.46,45.64 16.56,45.64
  pour Top (no thermals): 47.04,45 46.4,45.64 47.67,45.64
N$13
  Bottom 0.61: R5.1 49.33,52.24 51.48,50.08 54.02,50.08 55.42,51.48 R5/6.3
N$14
  Top 0.406: J11.TX0 72.57,19.73 72.57,26.46 63.3,35.73 33.32,35.73 27.99,30.4 J18.RX
N$15
  Top 0.406: J6.- 42.34,8.28 42.34,17.32 45.39,20.36 45.39,28.11 J17.VIN+
  Bottom 0.406: SJ2.2 46.96,29.84 J17.VIN+
N$16
  Top 0.406: J11.RX0 69.9,22.14 69.9,26.89 61.82,34.97 33.83,34.97 29.26,30.4 29.26,29.13 28.62,28.49 26.72,28.49 J18.TX
N$18
  Bottom 0.305: Q1.5 53.06,42.76
  Bottom 0.406: 53.06,42.76 53.06,41.95 53.5,41.51 U8.3
N$19
  Top 0.406: F1.2 J9.VBUS
N$20
  Bottom 0.305: U8.1 55.37,39.61 55.62,39.86 55.62,41.31 57.38,43.07 58.17,43.14 Q1.4
N$21  (via drill 0.35)
  Top 0.406: v57.58,13.25 50.85,6.52 J9.D+
  Bottom 0.406: v57.58,13.25 58.85,14.52 63.87,14.52 R4.1@VIA
N$22
  Bottom 0.305: U8.5 57.19,40.59 56.48,40.59 56.22,40.33 56.22,39.01 57.2,38.03 R8.1
  Bottom 0.406: C9.1 59.46,35.16 57.56,37.06 R8.1
N$23
  Bottom 0.406: Q2.3 46.89,40.54 46.89,37.21 R11.2
N$24  (via drill 0.35)
  Top 0.406: v56.4,13.25 50.2,7.05 J9.D-
  Bottom 0.406: R3.1@VIA 58.62,15.47 v56.4,13.25
N$25  (via drill 0.35)
  Top 0.406: 3.86,41.19 10.84,34.21 14.02,34.21 21,27.22 30,27.22 36.98,34.21 61.64,34.21 68.63,27.22 J11.AIN | v76.25,39.03 79.42,35.86 v79.42,26.21 | v75.23,24.81 75.36,24.68 75.36,16.17 75.23,16.05 75.23,6.78 72.44,3.98 70.28,3.98 68.5,2.2 S2.2 | 3.86,41.19 4.75,42.08 4.75,45 3.86,45.89 R2.2 | 3.86,41.19 R1.2 1.32,39.92 v1.32,35.48
  Bottom 0.406: v79.42,26.21 78.03,24.81 v75.23,24.81 69.77,24.81 J11.AIN | U5.3 72.52,42.76 v76.25,39.03
  pour Top: 3.86,41.19 4.75,42.08 4.75,40.3
N$26  (via drill 0.35)
  Top 0.406: S2.1@VIA 60.9,3.85 65.21,8.17 71.55,8.17 74.6,11.22 74.6,16.3 74.73,16.43 74.73,23.92 74.47,24.17 74.47,27.37 69.9,31.95 v69.9,36.11
  Top 0.61: S3.1 71.04,3.22 72.64,3.22 75.94,6.45 75.94,15.67 77.59,17.32 S4.3 SJ5.2
  Bottom 0.406: U5.1 U5.6 66.84,44.68 C5.2 | U5.1 71.91,44.68 71.53,44.3 71.53,39.77 70.41,38.65 U6.5 U6.4 69.9,37.62 v69.9,36.11 | C3.1 74.98,44.68 U5.1
  Bottom 0.61: S2.1@VIA 61.53,1.82 S3.1 69.82,1.82 71.73,3.73 SJ8.1 71.73,6.81 J12.+
N$27
  Bottom 0.61: R5/6.1 50.09,54.78 R6.2
N$28  (via drill 0.35)
  Top 0.406: v62.28,43.35 66.65,43.35 70.66,39.32 70.66,32.12 76,26.79 76,21.38 77.51,19.86 S4.2
  Top 0.61: S4.2 SJ4.2
  Bottom 0.406: U5.5 70.2,43.73 70.82,43.12 70.82,40.6 U6.6 66.33,39.6 SJ9.2 66.09,39.54 v62.28,43.35 59.87,45.76 41.2,45.76 38.15,42.72 38.15,35.57 38.56,35.16 R14.2
N$29  (via drill 0.35)
  Top 0.406: J11.A3 69.9,11.98 71.83,11.98 73.2,13.39 73.2,26.77 56.23,43.73 33.73,43.73 J2.SPD | v76.88,12.24 S4.5
  Top 0.61: S4.5 SJ7.2
  Bottom 0.406: J11.A3 69.9,11.98 76.63,11.98 v76.88,12.24
N$30  (via drill 0.35)
  Top 0.406: v72.44,17.06 J11.A1 71.17,16.43 69.9,17.7 69.9,18.97 69.26,19.6 67.99,19.6 67.36,20.24 67.36,27.55 61.47,33.45 37.26,33.45 v27.99,24.17
  Top 0.61: SJ4.1@V S4.9
  Bottom 0.406: J4.SDO/CS/INT v27.99,24.17 29.26,25.5 29.26,35.38 J2.RAIN | v72.44,17.06 73.96,18.59 82.29,18.59 SJ4.1@V
N$31
  Bottom 0.61: R5/6.2 53.77,56.18 44.91,56.18 43.61,54.96 43.61,53 41.96,51.35 29.16,51.35 28.31,50.51 U4.3
N$32  (via drill 0.35)
  Bottom 0.406: 19.1,48.18 22.27,45 28.62,45 30.66,47.04 C2.1 32.95,45 39.42,45 41.32,46.91 46.7,46.91 D2.C | S5.P$6 13.21,42.29 19.1,48.18 | v19.1,48.81 19.1,48.18
  Bottom 0.61: R5.2 46.09,51.97 48.6,49.45 D2.C
  pour Bottom (no thermals): 19.1,48.18 18.46,47.54 19.73,47.54
N$33
  Bottom 0.813: S5.P$1 S5.P$4
N$34  (via drill 0.35)
  Top 0.406: J8.B+ 54.66,15.79 v52.12,13.25
  Top 0.61: SJ1.2 S1.2
  Top 0.813: S1.2 10.72,15.55 J5.- 13,13.78 33.97,13.78 34.97,14.78 34.97,19.86 40.18,25.06 43.74,25.06 U1.OUT+
  Bottom 0.406: C13.1 48.94,9.12 48.31,9.76 Q4.3 51.36,12.5 v52.12,13.25 | R8.2 C10.1
  Bottom 0.61: R8.2 57.2,34.21 61.01,30.4 61.01,28.49 59.74,27.22 53.39,27.22 51.1,24.94
  Bottom 0.813: J8.B+ 54.66,21.38 51.1,24.94 U1.B+ U1.OUT+
N$35
  Bottom 0.406: R10.1 42.28,43.99 41.71,43.42 41.71,41.01 Q3.3 43.72,40.94 Q2.1
N$36
  Bottom 0.406: J6.+ 34.34,5.9 34.34,12.36 35.61,13.63 35.61,24.56 37.51,26.46 37.51,28.75 34.09,32.18 34.09,37.38 30.91,40.56 10.8,40.56 S5.P$5
N$37
  Bottom 0.406: R13.2 41.93,35.13 41.68,35.13 39.75,37.06 R14.1 39.62,37.27 39.62,39.96 Q3.1
N$38  (via drill 0.35)
  Top 0.406: B2.- 88.44,31.98 88.44,15.99 S4.7 | v40.69,38.65 v58.47,38.65
  Top 0.61: SJ6.2 S4.7
  Top 0.813: J13.- 74.2,50.92 72.44,49.16 B1.- 80.06,39.92 B2.-
  Bottom 0.406: Q3.2 40.69,40.79 v40.69,38.65 40.7,38.64 40.7,38.32 R13.1 42.29,37.06 44.19,35.16 R12.1 44.5,34.84 43.23,33.57 37.51,33.57 36.88,34.21 C11.2 | Q1.2 59.36,44.11 59.99,43.48 59.99,37.32 C9.2 59.74,37.38 v58.47,38.65 57.51,39.61 U8.6
  Bottom 0.813: U1.B- 56.31,23.29 60.25,23.29 62.15,25.19 | 62.15,25.19 65.33,28.37 77.44,28.37 80.5,31.42 B2.- | 62.15,25.19 62.15,35.34 60.73,37.06 C9.2
  pour Bottom: 62.15,25.32 65.33,28.37 62.15,31.54
N$39
  Bottom 0.406: U4.5 U4.4 27.12,53.89 21.17,53.89 19.95,52.67 17.41,52.67 11.57,46.83 S5.P$3
  Bottom 0.61: C1.1 30.21,54.79 29.26,53.84 U4.5
  Bottom 0.813: L1.2 37.13,55.35 36.28,54.5 32.84,54.5 31.93,55.42 C1.1
N$40  (via drill 0.35)
  Top 0.406: S3.2 70.92,0.55 50.85,0.55 47.36,4.04 v47.36,8.17
  Bottom 0.406: v47.36,8.17 Q4.2 45.45,10.2 45.13,9.88 C14.1 45.13,11.66 44.85,11.95 D6.C 44.88,12.92 44.55,13.25 41.25,13.25 40.69,12.69 SJ11.1
  Bottom 0.61: S3.2 73.15,2.79 SJ8.2 73.15,6.23 J12.-
N$41
  Top 0.61: J8.IN+ 43.86,16.43 U1.IN+ 46.18,4.39 D1.C
  Bottom 0.406: F2.1 55.61,3.73 45.52,3.73 U1.IN+
  Bottom 0.813: D3.C 84.38,33.8 77.88,27.3 66.17,27.3 56.56,17.7 48.94,17.7 J8.IN+
N$42
  Top 0.406: R3.2 J10.1
N$43
  Bottom 0.406: Q4.1 49.52,10.46 55.23,10.46 R17.2
N$44
  Bottom 0.406: D6.A 41.36,11.76 D7.P$1 42.88,6.01 53.02,6.01 R18.1 R17.1 56.95,7.22 58.72,9 58.98,9 F2.2
N$45
  Top 0.61: D1.A 48.85,13.63 F1.1
N$46
  Bottom 0.406: U7.3 70.22,30.72 69.77,30.27 66.85,30.27 66.01,31.11 66.01,37.87 SJ9.1 65.86,37.94 64.44,39.36 SJ10.1
N$47  (via drill 0.35)
  Top 0.406: J19.SCLK 23.73,11.17 39.37,11.17 41.71,13.51 41.71,17.52 44.63,20.44 v44.63,21.51 | v51.48,22.14 61.64,22.14 v64.18,19.6
  Bottom 0.406: J11.SCLK 69.9,19.6 v64.18,19.6 | v44.63,21.51 45.26,22.14 v51.48,22.14
N$48  (via drill 0.35)
  Top 0.406: J19.MOSI 20.85,12.29 38.55,12.29 40.41,14.14 40.41,17.85 43.1,20.55 v43.1,20.75
  Bottom 0.406: J11.MOSI 69.9,22.14 62.38,22.14 56.66,16.43 47.42,16.43 v43.1,20.75
N$49
  Top 0.406: J19.CS 16,8.17 20.96,3.22 31.8,3.22 37.51,8.93 U3.2
  Bottom 0.406: U2.2 U3.2 | U2.2 56.82,14.78 58.47,16.43 65.45,16.43 J11.A2 | U2.2 39.42,18.62 J7.SIG 39.42,21.16 R15.1
N$50  (via drill 0.35)
  Top 0.406: J19.MISO 22.29,11.73 38.91,11.73 41.07,13.89 41.07,17.68 43.86,20.47 v43.86,22.78 | v64.18,23.41 v50.21,23.41
  Bottom 0.406: J11.MISO v64.18,23.41 | v43.86,22.78 44.5,23.41 v50.21,23.41
VCC  (via drill 0.35)
  Top 0.61: SJ3.1@V S4.10 | v80.69,24.68 79.42,24.68 78.15,25.95 78.15,30.4 v72.69,36.11
  other vias: 19.1,53.89
  pour Bottom (isolate 0.305, rank 5): -1.92,58.5 -1.92,-1.56 90.86,-1.56 90.86,58.5

### Text on the board
Bottom: v4.1
tPlace: AIN | GND | 10068-BCS-A4a v4.1 | MISO | MOSI | SDA | SCL | GND | Vcc | RX0 | SCLK | A0 | TX0 | In+ | In- | Bat- | Bat+ | SDA | A1 | Vcc | GND | SCL | SDA | RST | ADD | A2 | SCL | CSB / SDO / WAK | SDO / CS / INT | A3 | Vcc | D+ | D-
bPlace: Rx | Vin+ | Vin- | SDA | SCL | GND | Vcc | digitalconcepts.net.au | GND | Tx | Vcc | S/N | 1 | 2 | 3 | 4
tNames: Timer Trim | J12 | ON
bNames: Vcc | GND | Boost | Bypass | Boost | J1 | J2
tValues: SDA | SCL | GND | Vcc | GND | Speed | Dir'n | Rain | Vcc | Monitor Bypass | TP5000 Interface | External / Power / Switch
bValues: MIC5219 / AP2112 | SDA | SCL | GND | Vcc | MOSFET / Bypass